# EAGLE design VideoOut (EAGLE 7.6.0)
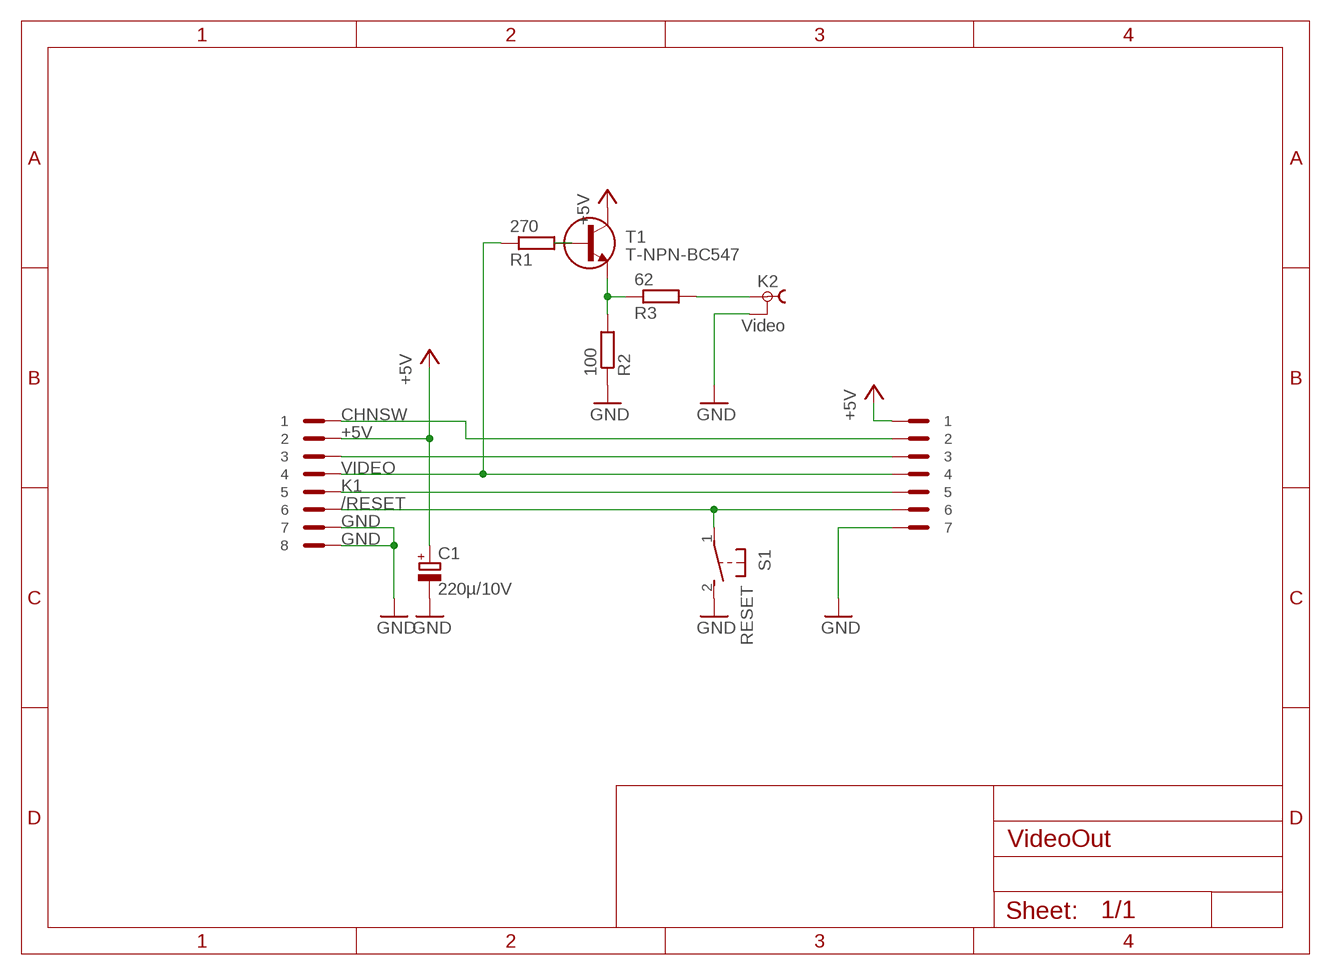
[diagram p0: schematic, sheet 1]

## Parts
C1  220µ/10V  CPOL-EUE2.5-6  [E2,5-6]
K2  Video  TOBU3  [TOBU3]
K3  PINHEAD-1X7  [PINHEAD1X7]
K6  PINHEAD-2X4  [PINHEAD2X4]
R1  270  RR207/10  [R207/10]
R2  100  RR207/10  [R207/10]
R3  62  RR207/10  [R207/10]
S1  RESET  31-XX  [B3F-31XX]
T1  T-NPN-BC547  [TO92]

## Nets
+5V: C1.+ K3.1 K6.2 T1.C
/RESET: K3.6 K6.6 S1.1(P)
CHNSW: K3.2 K6.1
GND: C1.- K2.2 K2.2@1 K2.2@2 K3.7 K6.7 K6.8 R2.1 S1.2(S)
K1: K3.5 K6.5
N$1: K3.3 K6.3
N$6: R1.2 T1.B
N$7: R2.2 R3.1 T1.E
N$23: K2.1 R3.2
VIDEO: K3.4 K6.4 R1.1

## Library data of the parts
C1 = rcl:CPOL-EU: POLARIZED CAPACITOR, European symbol
K2 = con-hirschmann:TOBU3: Female Cinch CONNECTOR ( RCA Jack ); MF: FARNELL; MPN: TOBU 3; OC_FARNELL: 592791; OC_NEWARK: 06WX5914
K3 = sinclair:PINHEAD-1X7
K6 = sinclair:PINHEAD-2X4
R1-R3 = sinclair:R
S1 = switch-omron:31-XX: OMRON SWITCH; MPN: B3F-3100; OC_FARNELL: 959704; OC_NEWARK: 36M3582
T1 = sinclair:T-NPN-BC547

## Board
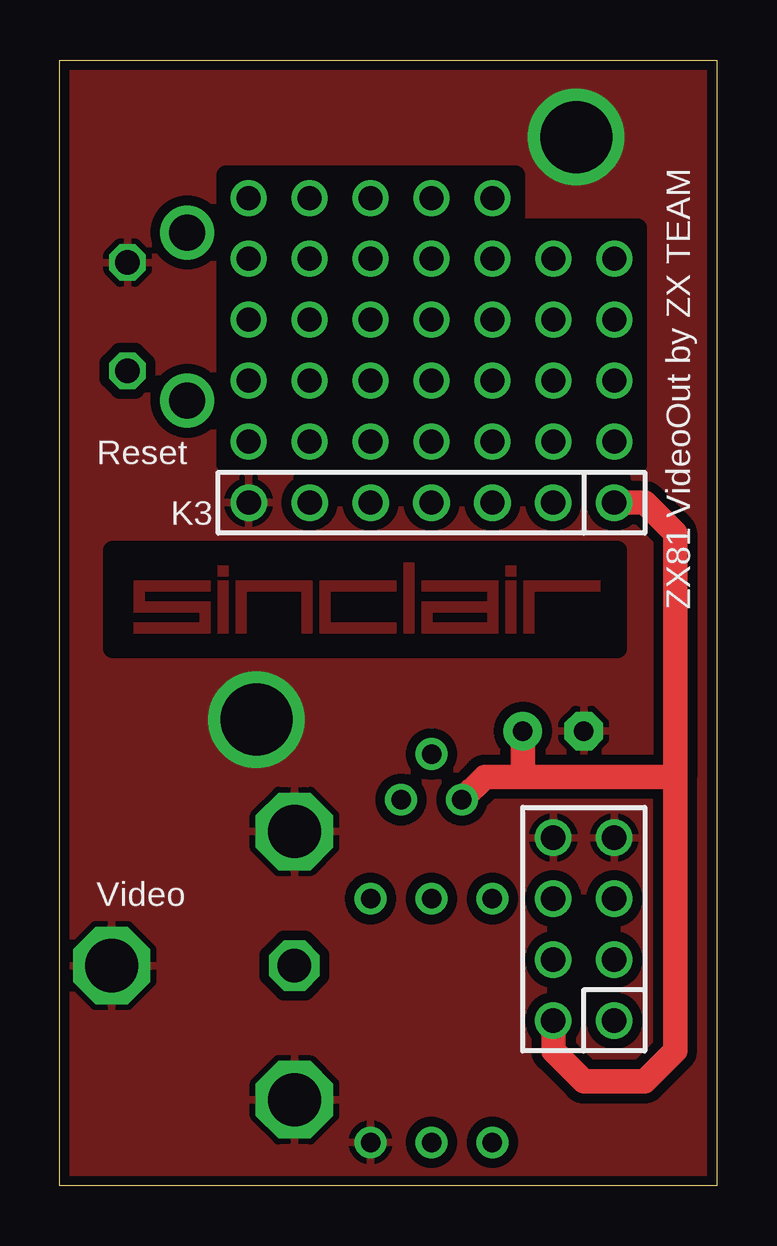
[diagram p1: board, top side]
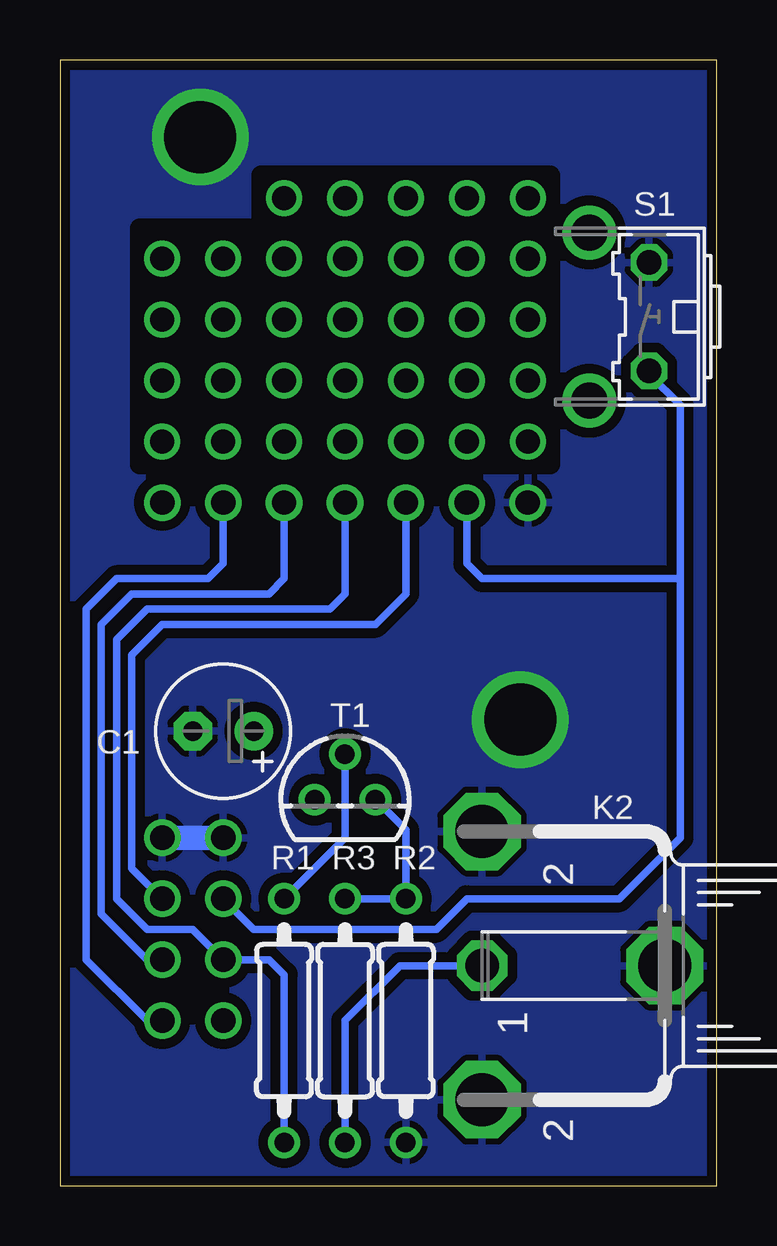
[diagram p2: board, bottom side, seen from below]

Size 27.38 x 46.92 mm. Coordinates in mm from the lower left corner, seen from the top.
Outline: 27.38,0 0,0 0,46.92 27.38,46.92 27.38,0
Copper layers (1*16): Top 0.035mm / dielectric 1.5mm / Bottom 0.035mm
Design rules "default *": minimum track width 10mil, minimum drill 0.3mm, track to track 8mil, track to pad 8mil, pad to pad 8mil, via to via 8mil, smd to smd 8mil, copper to edge 8mil, drill to drill 8mil, minimum pad ring 10mil, minimum via ring 8mil, stop-mask expansion 4mil, vias tented up to drill 0.6mm, thermal gap 10mil
tRestrict: 10 lines
bRestrict: 6 lines

### Footprints (pad centres in the part's own frame; a part is rotated, then mirrored left to right if it is on the bottom)
E2,5-6 = drill 0.813 pad 1.6: + -1.27,0 | drill 0.813 pad 1.6 octagon: - 1.27,0
TOBU3 = drill 1.397 octagon: 1 0,-2.54 | drill 2.21 octagon: 2 5.588,-2.54; 2@1 -5.588,-2.54; 2@2 0,5.08
PINHEAD1X7 = drill 1.016: 1 -7.62,0; 2 -5.08,0; 3 -2.54,0; 4 0,0; 5 2.54,0; 6 5.08,0; 7 7.62,0
PINHEAD2X4 = drill 1.016: 1 -7.62,0; 2 -7.62,2.54; 3 -5.08,0; 4 -5.08,2.54; 5 -2.54,0; 6 -2.54,2.54; 7 0,0; 8 0,2.54
R207/10 = drill 0.813: 1 -5.08,0; 2 5.08,0
B3F-31XX = drill 1.016 octagon: 1 -2.261,-1.245; 2 2.261,-1.245 | drill 1.499 pad 2.159: 3 -3.505,1.245; 4 3.505,1.245
TO92 = drill 0.813: B 0,1.905; C -1.27,0; E 1.27,0

### Placement (x,y rotation side)
C1  20.57,18.95 180 bottom
K2  7.23,9.17 270 bottom
K3  15.49,28.47 180 top
K6  23.11,14.5 90 top
R1  18.03,6.88 90 bottom
R2  12.95,6.88 90 bottom
R3  15.49,6.88 270 bottom
S1  4.06,36.22 90 bottom
T1  15.49,16.09 0 bottom

### Tracks (layer width: path | path; a pad name or v marks a point on that pad's centre or on a via)
+5V
  Top 1.016: K6.2 20.57,5.61 21.84,4.34 24.38,4.34 25.65,5.61 25.65,17.04 | 25.65,17.04 19.3,17.04 | 19.3,17.04 17.71,17.04 T1.C | K3.1 24.38,28.47 25.65,27.2 25.65,17.04 | C1.+ 19.3,17.04
/RESET
  Bottom 0.305: K6.6 19.3,10.69 11.68,10.69 10.41,11.96 4.06,11.96 1.52,14.5 1.52,25.3 | 1.52,25.3 1.52,32.53 2.81,33.83 S1.1 | K3.6 10.41,25.93 9.78,25.3 1.52,25.3
CHNSW
  Top 0.305: K6.1
  Bottom 0.305: K6.1 23.75,6.88 26.29,9.42 26.29,24.03 25.02,25.3 21.2,25.3 20.57,25.93 K3.2
GND  (via drill 3)
  Bottom 1.016: K6.8 K6.7
  other vias: 21.52,43.71 8.19,19.42
  pour Bottom (isolate 0.406): 0,0 0,46.88 27.38,46.88 27.38,0
  pour Top (isolate 0.406): 0,0 0,46.88 27.38,46.88 27.38,0
K1
  Bottom 0.305: K6.5 24.38,13.23 24.38,22.12 23.11,23.39 14.22,23.39 12.95,24.66 K3.5
N$1
  Bottom 0.305: K6.3 23.75,9.42 25.65,11.33 25.65,23.39 24.38,24.66 18.66,24.66 18.03,25.3 K3.3
N$3
  pour Top: 3.12,25.18 6.24,25.18 6.24,24.8 3.49,24.8 3.49,24.3 6.24,24.3 6.24,23.05 3.12,23.05 3.12,23.43 5.87,23.43 5.87,23.93 3.12,23.93
  pour Top: 6.62,25.18 6.99,25.18 6.99,23.05 6.62,23.05
  pour Top: 6.62,25.43 6.62,25.8 6.99,25.8 6.99,25.43
  pour Top: 7.37,23.05 7.37,25.18 10.49,25.18 10.49,23.05 10.12,23.05 10.12,24.8 7.74,24.8 7.74,23.05
  pour Top: 13.99,23.05 10.87,23.05 10.87,25.18 13.99,25.18 13.99,24.8 11.24,24.8 11.24,23.43 13.99,23.43
  pour Top: 14.37,23.05 14.37,25.93 14.74,25.93 14.74,23.05
  pour Top: 15.12,25.18 18.24,25.18 18.24,23.05 17.86,23.05 17.86,24.8 15.12,24.8
  pour Top: 18.61,25.18 18.99,25.18 18.99,23.05 18.61,23.05
  pour Top: 18.61,25.43 18.61,25.8 18.99,25.8 18.99,25.43
  pour Top: 19.36,23.05 19.36,25.18 22.49,25.18 22.49,24.8 19.74,24.8 19.74,23.05
N$4  (via drill 1)
  other vias: 7.87,41.17
N$5  (via drill 1)
  other vias: 10.41,41.17
N$6
  Bottom 0.305: T1.B 15.49,14.5 R1.2
N$7
  Bottom 0.305: R3.1 R2.2 12.95,14.82 T1.E
N$8  (via drill 1)
  other vias: 12.95,41.17
N$9  (via drill 1)
  other vias: 15.49,41.17
N$10  (via drill 1)
  other vias: 18.03,41.17
N$20  (via drill 1)
  other vias: 7.87,31.01
N$21  (via drill 1)
  other vias: 10.41,31.01
N$22  (via drill 1)
  other vias: 12.95,31.01
N$23
  Bottom 0.305: R3.2 15.49,6.88 13.2,9.17 K2.1
N$24  (via drill 1)
  other vias: 15.49,31.01
N$25  (via drill 1)
  other vias: 18.03,31.01
N$26  (via drill 1)
  other vias: 20.57,31.01
N$27  (via drill 1)
  other vias: 23.11,31.01
N$30  (via drill 1)
  other vias: 7.87,33.55
N$31  (via drill 1)
  other vias: 10.41,33.55
N$32  (via drill 1)
  other vias: 12.95,33.55
N$33  (via drill 1)
  other vias: 15.49,33.55
N$34  (via drill 1)
  other vias: 18.03,33.55
N$35  (via drill 1)
  other vias: 20.57,33.55
N$36  (via drill 1)
  other vias: 23.11,33.55
N$37  (via drill 1)
  other vias: 7.87,36.09
N$38  (via drill 1)
  other vias: 10.41,36.09
N$39  (via drill 1)
  other vias: 12.95,36.09
N$40  (via drill 1)
  other vias: 15.49,36.09
N$41  (via drill 1)
  other vias: 18.03,36.09
N$42  (via drill 1)
  other vias: 20.57,36.09
N$43  (via drill 1)
  other vias: 23.11,36.09
N$45  (via drill 1)
  other vias: 7.87,38.63
N$46  (via drill 1)
  other vias: 10.41,38.63
N$47  (via drill 1)
  other vias: 12.95,38.63
N$48  (via drill 1)
  other vias: 15.49,38.63
N$49  (via drill 1)
  other vias: 18.03,38.63
N$50  (via drill 1)
  other vias: 20.57,38.63
N$51  (via drill 1)
  other vias: 23.11,38.63
N$52
  pour Top: 17.86,23.05 15.12,23.05 15.12,24.3 17.86,24.3 17.86,23.93 15.49,23.93 15.49,23.43 17.86,23.43
VIDEO
  Bottom 0.305: R1.1 18.03,8.79 18.66,9.42 K6.4 21.84,10.69 23.75,10.69 25.02,11.96 25.02,22.75 23.75,24.03 16.12,24.03 15.49,24.66 K3.4

### Text on the board
tPlace: Reset | ZX81 VideoOut by ZX TEAM | Video